# Altium schematic sheet BLE Reader.SchDoc
size 420 x 297 mm; Scale: 1:1; DocumentType: Схема электрическая принципиальная; FirstReferrence: АБВГ.123456.001
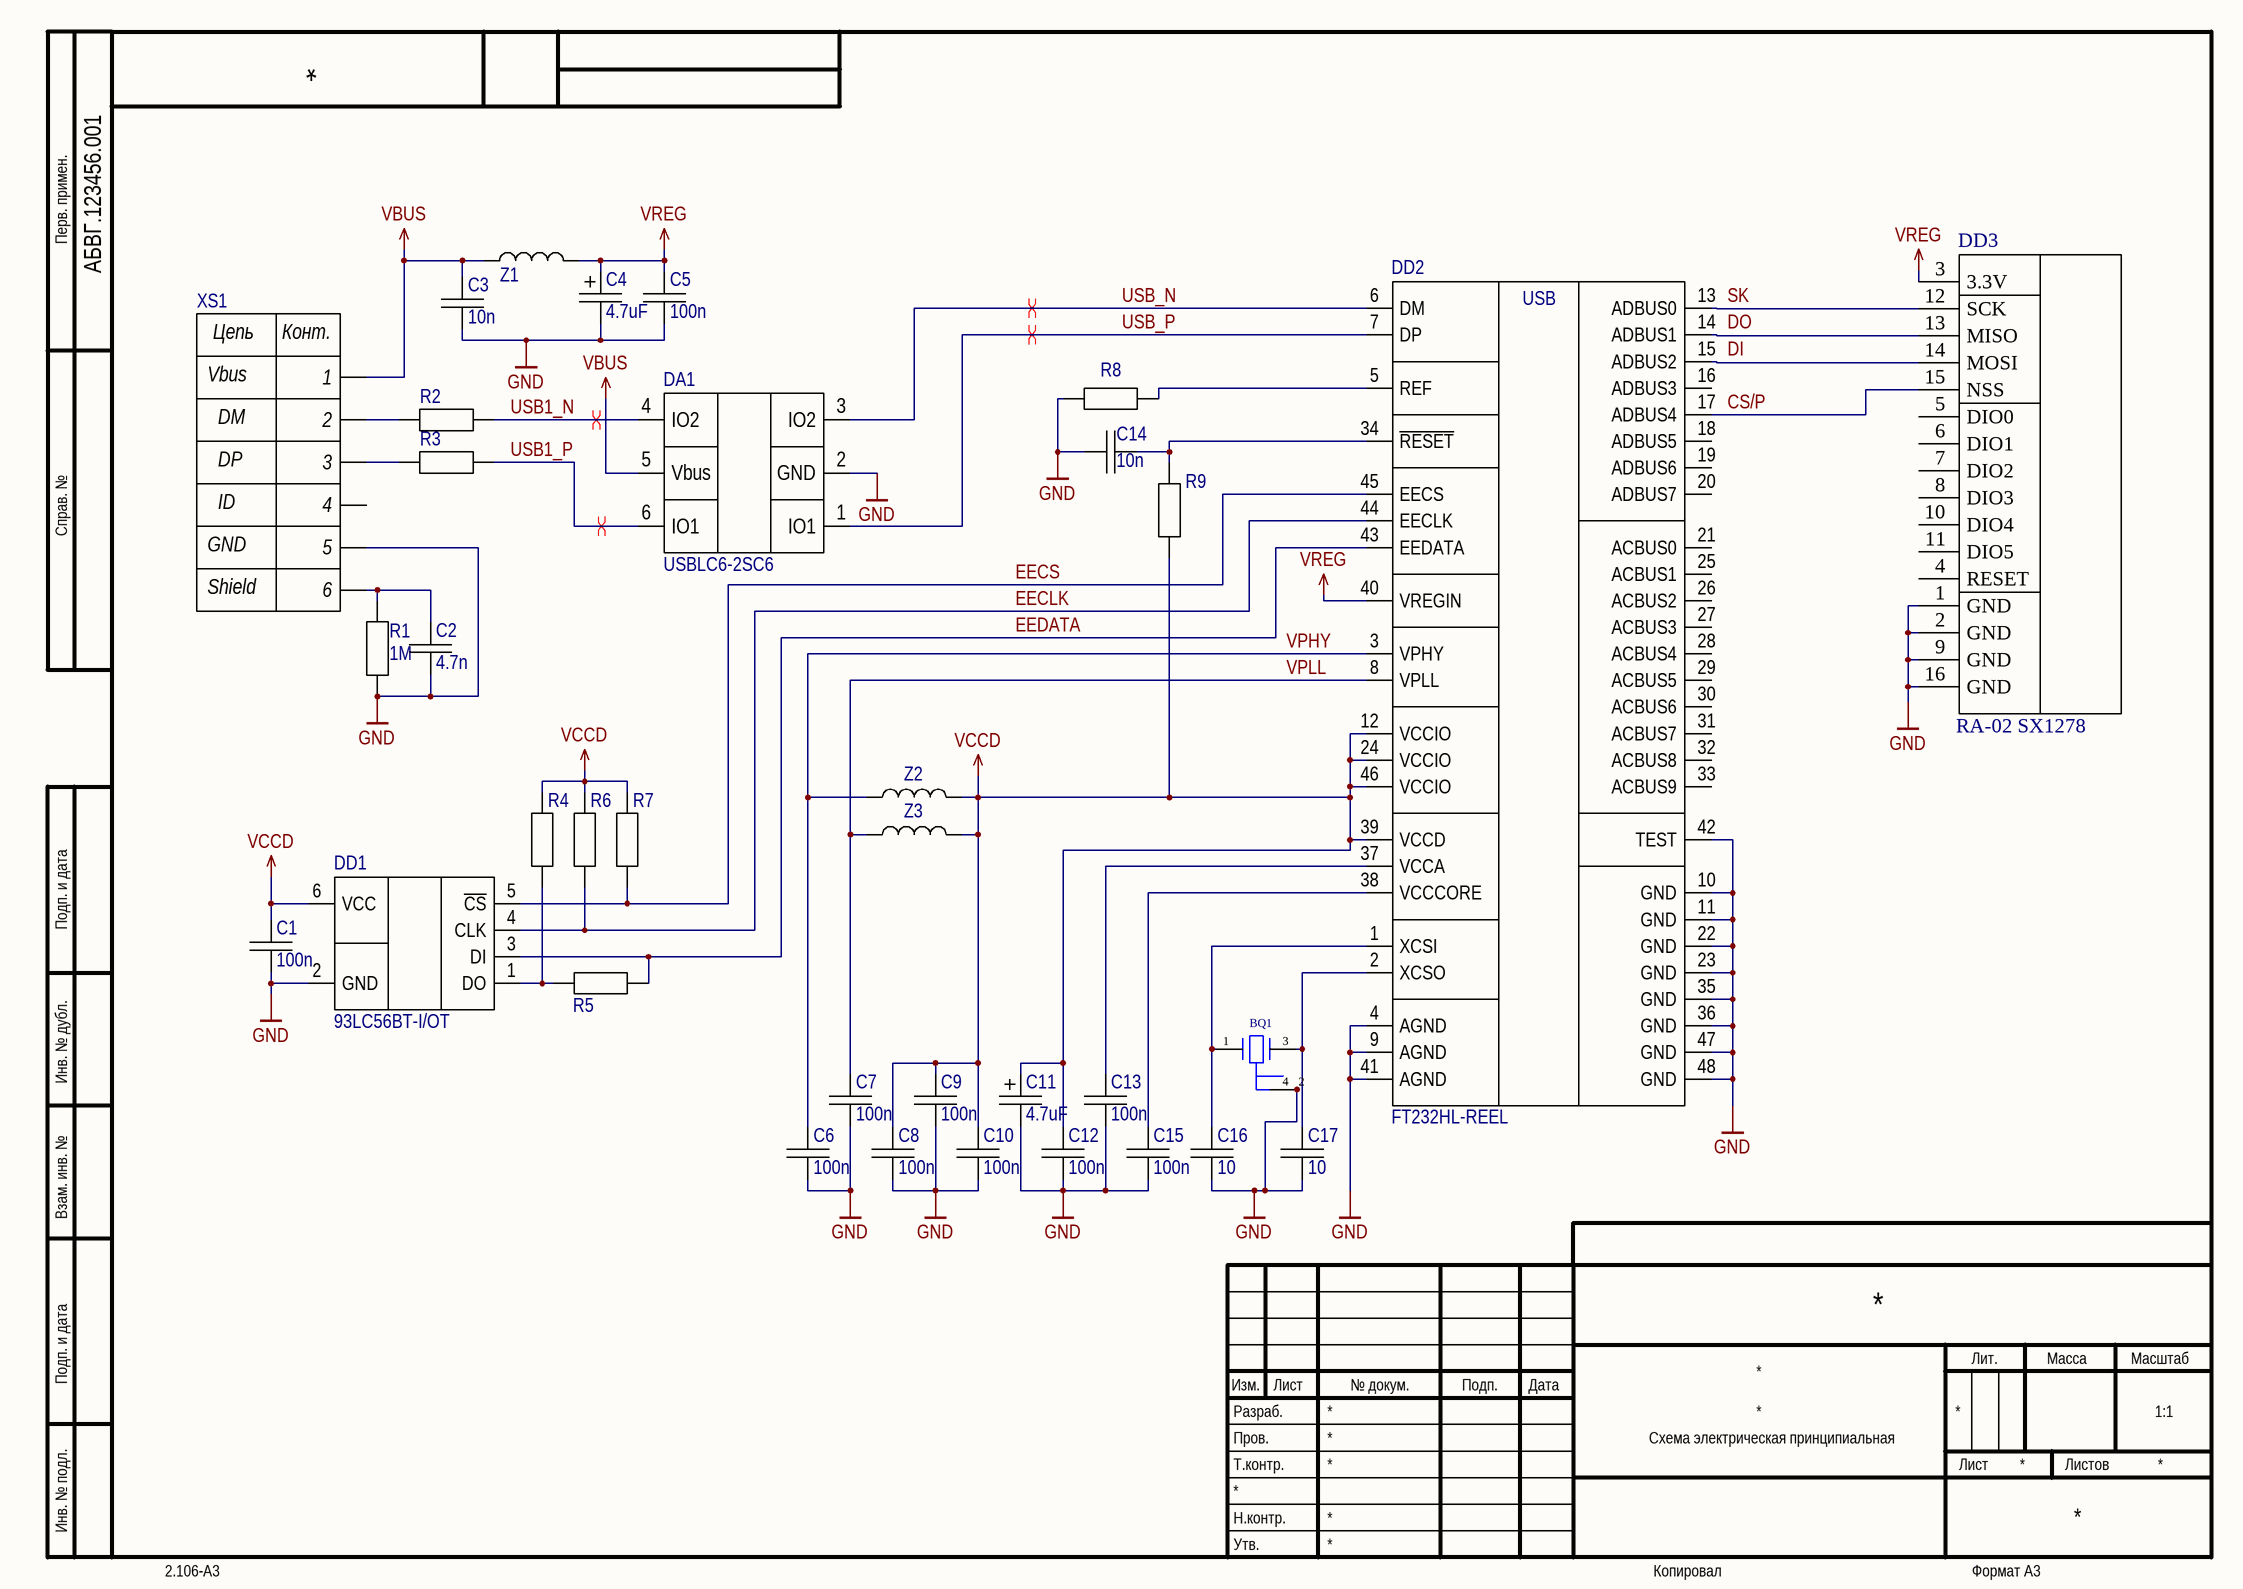
[diagram p0: BLE Reader.SchDoc]

## Parts
BQ1  ABM8G-12.000MHZ-4Y-T3  [Abracon_ABM8G_0]  (value not drawn)
C1  value 100n  [1608[0603]]  (hidden comment: *)
C2  value 4.7n  [1608[0603]]  (hidden comment: *)
C3  value 10n  [1608[0603]]  (hidden comment: *)
C4  value 4.7uF  [C1206]  (hidden comment: *)
C5  value 100n  [1608[0603]]  (hidden comment: *)
C6  value 100n  [1608[0603]]  (hidden comment: *)
C7  value 100n  [1608[0603]]  (hidden comment: *)
C8  value 100n  [1608[0603]]  (hidden comment: *)
C9  value 100n  [1608[0603]]  (hidden comment: *)
C10  value 100n  [1608[0603]]  (hidden comment: *)
C11  value 4.7uF  [C1206]  (hidden comment: *)
C12  value 100n  [1608[0603]]  (hidden comment: *)
C13  value 100n  [1608[0603]]  (hidden comment: *)
C14  value 10n  [1608[0603]]  (hidden comment: *)
C15  value 100n  [1608[0603]]  (hidden comment: *)
C16  value 10  [1608[0603]]  (hidden comment: *)
C17  value 10  [1608[0603]]  (hidden comment: *)
DA1  USBLC6-2SC6  [STMicroelectronics_USBLC6-2SC6_0]
DD1  93LC56BT-I/OT  [SOT-23-OT6_N]
DD2  FT232HL-REEL  [LQFP-48_L]
DD3  RA-02 SX1278  [RA-02]
R1  value 1M  [J1-0603]  (hidden comment: R1608)
R2  R1608  [J1-0603]  (value not drawn)
R3  R1608  [J1-0603]  (value not drawn)
R4  R1608  [J1-0603]  (value not drawn)
R5  R1608  [J1-0603]  (value not drawn)
R6  R1608  [J1-0603]  (value not drawn)
R7  R1608  [J1-0603]  (value not drawn)
R8  R1608  [J1-0603]  (value not drawn)
R9  R1608  [J1-0603]  (value not drawn)
XS1  UX60SC-MB-5S8(80)  [UX60SC-MB-5S8(80)]  (value not drawn)
Z1  BLM18AG601SN1D  [INDC1608L]  (value not drawn)
Z2  BLM18AG601SN1D  [INDC1608L]  (value not drawn)
Z3  BLM18AG601SN1D  [INDC1608L]  (value not drawn)

## Nets
GND: BQ1.2(GND) BQ1.4(GND) C1.1 C2.1 C3.1 C4.2 C5.1 C6.1 C7.1 C8.1 C9.1 C10.1 C11.2 C12.1 C13.1 C14.2 C15.1 C16.1 C17.1 DA1.2(GND) DD1.2(GND) DD2.4(AGND) DD2.9(AGND) DD2.10(GND) DD2.11(GND) DD2.22(GND) DD2.23(GND) DD2.35(GND) DD2.36(GND) DD2.41(AGND) DD2.42(TEST) DD2.47(GND) DD2.48(GND) DD3.1(GND) DD3.2(GND) DD3.9(GND) DD3.16(GND) R1.2 R8.2 XS1.5
VBUS: C3.2 DA1.5(Vbus) XS1.1 Z1.1
VCCD: C1.2 C8.2 C9.2 C10.2 C11.1 C12.2 DD1.6(VCC) DD2.12(VCCIO) DD2.24(VCCIO) DD2.39(VCCD) DD2.46(VCCIO) R4.2 R6.2 R7.2 R9.1 Z2.2 Z3.2
VREG: C4.1 C5.2 DD2.40(VREGIN) DD3.3(3.3V) Z1.2
CS/P: DD2.17(ADBUS4) DD3.15(NSS)
EECLK: DD1.4(CLK) DD2.44(EECLK) R6.1
EECS: DD1.5(~{CS}) DD2.45(EECS) R7.1
EEDATA: DD1.3(DI) DD2.43(EEDATA) R5.1
SK: DD2.13(ADBUS0) DD3.12(SCK)
USB1_N: DA1.4(IO2) R2.1
USB1_P: DA1.6(IO1) R3.1
USB_N: DA1.3(IO2) DD2.6(DM)
USB_P: DA1.1(IO1) DD2.7(DP)
VPHY: C6.2 DD2.3(VPHY) Z2.1
VPLL: C7.2 DD2.8(VPLL) Z3.1
NetBQ1_1: BQ1.1 C16.2 DD2.1(XCSI)
NetBQ1_3: BQ1.3 C17.2 DD2.2(XCSO)
NetC2_2: C2.2 R1.1 XS1.6
NetC13_2: C13.2 DD2.37(VCCA)
NetC14_1: C14.1 DD2.34(~{RESET}) R9.2
NetC15_2: C15.2 DD2.38(VCCCORE)
NetDD1_1: DD1.1(DO) R4.1 R5.2
NetDD2_5: DD2.5(REF) R8.1
NetDD2_14: DD2.14(ADBUS1) DD3.13(MISO)
NetDD2_15: DD2.15(ADBUS2) DD3.14(MOSI)
NetR2_2: R2.2 XS1.2
NetR3_2: R3.2 XS1.3

Not connected (* = marked no-connect by the designer): DD2 16(ADBUS3) 18(ADBUS5) 19(ADBUS6) 20(ADBUS7) 21(ACBUS0) 25(ACBUS1) 26(ACBUS2) 27(ACBUS3) 28(ACBUS4) 29(ACBUS5) 30(ACBUS6) 31(ACBUS7) 32(ACBUS8) 33(ACBUS9); DD3 4(RESET) 5(DIO0) 6(DIO1) 7(DIO2) 8(DIO3) 10(DIO4) 11(DIO5); XS1 4

## Layout directives
differential pair: USB1_N, USB1_P, USB_N, USB_P

## Notes on the sheet
- Labels drawn without touching a wire or pin: DI, DO
- Перв. примен.
- Справ. №
- Подп. и дата
- Инв. № дубл.
- Взам. инв. №
- Разраб.
- Изм.
- Лист
- № докум.
- Подп.
- Дата
- Лит.
- Масса
- Масштаб
- Пров.
- Т.контр.
- Листов
- Инв. № подл.
- Утв.
- Н.контр.
- 2.106-A3
- Копировал
- Формат А3
- (in symbol FT232HL-REEL) USB
- (in symbol UX60SC-MB-5S8(80)) Цепь; Конт.; Vbus; DM; DP; ID; GND; Shield

## Library data of the parts
C1 C5-C10 C12 C13 C15 = CC1608: Конденсатор 1.6x0.8 мм; Tolerance: ±10%; ТКЕ: X7R; РКД Наименование: CC1608M - NP0 - 16 V - 100 nF ±10%; Voltage: *; Type: *; PartNo: *; Supplier Part Number 1: *; Supplier 1: *
C2 = CC1608: Конденсатор 1.6x0.8 мм; Tolerance: ±10%; ТКЕ: X7R; РКД Наименование: CC1608M - NP0 - 16 V - 4.7 nF ±10%; Voltage: *; Type: *; PartNo: *; Supplier Part Number 1: *; Supplier 1: *
C3 C14 = CC1608: Конденсатор 1.6x0.8 мм; Tolerance: ±10%; ТКЕ: X7R; РКД Наименование: CC1608M - NP0 - 16 V - 10 nF ±10%; Voltage: *; Type: *; PartNo: *; Supplier Part Number 1: *; Supplier 1: *
C4 C11 = CT3216-A: Tantalum Surface Mount Capacitor, Size A; Voltage: 16; РКД Наименование: CT3216M - xx V - 4.7 uF ±10%; Type: *; PartNo: *; Supplier Part Number 1: *; Supplier 1: *
C16 C17 = CC1608: Конденсатор 1.6x0.8 мм; Tolerance: ±10%; ТКЕ: X7R; РКД Наименование: CC1608M - NP0 - 16 V - 10 pF ±10%; Voltage: *; Type: *; PartNo: *; Supplier Part Number 1: *; Supplier 1: *
DA1 = USBLC6-2SC6: USB protection IC; Manufacturer: STMicroelectronics; Direction: Bidirectional,Unidirectional; Capacitance: 3.5pF; Clamping Voltage: 17V; Operating Supply Voltage: 1.1V; Number of Channels: 2; Breakdown Voltage: 6V; Reverse Standoff Voltage: 5.25V; Power Line Protection: Yes; Test Current: 1mA; Max Reverse Leakage Current: 150nA; Peak Pulse Current: 5A; Element Configuration: Dual; Data Rate: 480Mbps; Number of Elements: 1; Working Voltage: 5V; PartNo: USBLC6-2SC6; Supplier 1: Digi-Key; Manufacturer Part Number: USBLC6-2SC6; Stock 1: 165611; Pricing 1: 1=0.49, 10=0.419, 100=0.3131, 500=0.24602, 1000=0.1901 (USD); Mount: Surface Mount; Case/Package: SOT-23; Number of Pins: 6; Contact Plating: Matte,Tin; Min Operating Temperature: -40°C; Max Operating Temperature: 125°C; Packaging: Tape and Reel; Package Quantity: 3000; Termination: SMD/SMT; Number of Bidirectional Channels: 2; Min Breakdown Voltage: 6V; ESD Protection: Yes; Leakage Current: 150nA; Reverse Breakdown Voltage: 6V; Polarity: Bidirectional,Unidirectional; Max Breakdown Voltage: 6V; Length: 3.05mm; Height: 1.3mm; Width: 1.75mm; Depth: 1.75mm; Radiation Hardening: No; REACH SVHC: No SVHC; Lead Free: Lead Free; ComponentLink1URL: http://www.farnell.com/datasheets/1690354.pdf; ComponentLink1Description: http://www.farnell.com/datasheets/1690354.pdf; ComponentLink2URL: http://www.st.com/content/ccc/resource/technical/document/datasheet/06/1d/48/9c/6c/20/4a/b2/CD00050750.pdf/files/CD00050750.pdf/jcr:content/translations/en.CD00050750.pdf; ComponentLink2Description: http://www.st.com/content/ccc/resource/technical/document/datasheet/06/1d/48/9c/6c/20/4a/b2/CD00050750.pdf/files/CD00050750.pdf/jcr:content/translations/en.CD00050750.pdf; ComponentLink3URL: http://www.st.com/web/en/resource/technical/document/datasheet/CD00050750.pdf; ComponentLink3Description: http://www.st.com/web/en/resource/technical/document/datasheet/CD00050750.pdf; ComponentLink4URL: http://datasheet.iiic.cc/stmicroelectronics/USBLC6-2SC6.pdf; ComponentLink4Description: http://datasheet.iiic.cc/stmicroelectronics/USBLC6-2SC6.pdf; ComponentLink5URL: http://www.produktinfo.conrad.com/datenblaetter/1100000-1199999/001184109-da-01-en-IC_ESD_PROTECTI_USBLC6_2SC6_SOT_23_6_STM.pdf; ComponentLink5Description: http://www.produktinfo.conrad.com/datenblaetter/1100000-1199999/001184109-da-01-en-IC_ESD_PROTECTI_USBLC6_2SC6_SOT_23_6_STM.pdf; Supplier Part Number 1: 497-5235-1-ND
DD1 = 93LC56BT-I/OT: IC EEPROM 2K SPI 2MHZ SOT23-6; Manufacturer: Microchip; Density: 2Kb; Interface: Serial; Max Supply Voltage: 5.5V; Min Supply Voltage: 2.5V; Access Time: 250ns; Nominal Supply Current: 2mA; Supplier 1: Digi-Key; Manufacturer Part Number: 93LC56BT-I/OT; Stock 1: 30936; Pricing 1: 1=0.23, 25=0.2164, 100=0.2119 (USD); Mount: Surface Mount; Case/Package: SOT-23; Number of Pins: 6; Contact Plating: Matte,Tin; Min Operating Temperature: -40°C; Max Operating Temperature: 85°C; Max Frequency: 2MHz; Packaging: Tape and Reel; Package Quantity: 3000; Memory Size: 2Kb; Frequency: 2MHz; Memory Type: EEPROM; Length: 3.1mm; Height: 1.3mm; Width: 1.8mm; Radiation Hardening: No; REACH SVHC: No SVHC; Lead Free: Lead Free; ComponentLink1URL: http://ww1.microchip.com/downloads/jp/DeviceDoc/jp013939.pdf; ComponentLink1Description: http://ww1.microchip.com/downloads/jp/DeviceDoc/jp013939.pdf; ComponentLink2URL: http://www.microchip.com/mymicrochip/filehandler.aspx?ddocname=en013939; ComponentLink2Description: http://www.microchip.com/mymicrochip/filehandler.aspx?ddocname=en013939; Supplier Part Number 1: 93LC56BT-I/OTCT-ND
DD2 = FT232HL-REEL: IC HS USB TO UART/FIFO 48LQFP; Manufacturer: FTDI; Max Supply Voltage: 3.63V; Interface: RS-232,RS-422,RS-485,UART; Operating Supply Current: 24mA; Min Supply Voltage: 2.97V; Operating Supply Voltage: 3.3V; Number of Channels: 1; Nominal Supply Current: 60mA; Data Rate: 12Mbps; Supplier 1: Digi-Key; Manufacturer Part Number: FT232HL-REEL; Stock 1: 26419; Pricing 1: 1=4.25, 10=3.55, 100=3.1, 250=2.95, 500=2.85002 (USD); Mount: Surface Mount; Case/Package: LQFP; Number of Pins: 48; Weight: 0.006409oz; Min Operating Temperature: -40°C; Max Operating Temperature: 85°C; Packaging: Tape and Reel; Package Quantity: 1; Length: 7mm; Height: 1.4mm; Width: 7mm; Lead Free: Lead Free; REACH SVHC: No SVHC; ComponentLink1URL: http://www.ftdichip.com/Support/Documents/DataSheets/ICs/DS_FT232H.pdf; ComponentLink1Description: http://www.ftdichip.com/Support/Documents/DataSheets/ICs/DS_FT232H.pdf; ComponentLink2URL: http://www.farnell.com/datasheets/1913746.pdf; ComponentLink2Description: http://www.farnell.com/datasheets/1913746.pdf; ComponentLink3URL: http://www.mouser.com/ds/2/163/DS_FT232H-11324.pdf; ComponentLink3Description: http://www.mouser.com/ds/2/163/DS_FT232H-11324.pdf; Supplier Part Number 1: 768-1101-1-ND
DD3 = RA-02
R1 = R1608: Резистор 1.6x0.8 мм; Manufacturer Part Number: RC0603JR-071ML; Tolerance: ±5%; РКД Наименование: RC1608M - 1 MOhm ±5%; Type: *; PartNo: *; Supplier 1: *; Supplier Part Number 1: 311-1.0MGRCT-ND
R2 R3 = R1608: Резистор 1.6x0.8 мм; Tolerance: ±1%; РКД Наименование: RC1608M - 22 Ohm ±1%; Value: 22; Type: *; PartNo: *; Supplier 1: *; Supplier Part Number 1: *
R4 R6 R7 R9 = R1608: Резистор 1.6x0.8 мм; Tolerance: ±5%; РКД Наименование: RC1608M - 10 kOhm ±5%; Value: 10k; Type: *; PartNo: *; Supplier 1: *; Supplier Part Number 1: *
R5 = R1608: Резистор 1.6x0.8 мм; Tolerance: ±5%; РКД Наименование: RC1608M - 2 kOhm ±5%; Value: 2k; Type: *; PartNo: *; Supplier 1: *; Supplier Part Number 1: *
R8 = R1608: Резистор 1.6x0.8 мм; Tolerance: ±1%; РКД Наименование: RC1608M - 12 kOhm ±1%; Value: 12k; Type: *; PartNo: *; Supplier 1: *; Supplier Part Number 1: *
XS1 = UX60SC-MB-5S8(80): USB - mini B USB 2.0 Receptacle Connector 5 Position Surface Mount, Right Angle; Through Hole; Manufacturer: Hirose; Voltage Rating: 30V; Current Rating: 1A; Number of Contacts: 5; Supplier 1: Digi-Key; Supplier Part Number 1: H125762CT-ND; Manufacturer Part Number: UX60SC-MB-5S8(80); Stock 1: 4220; Pricing 1: 1=0.8, 10=0.701, 25=0.66, 50=0.6326, 100=0.605, 250=0.55, 500=0.495 (USD); Mount: Surface Mount,Horizontal,Through Hole; Contact Material: Copper Alloy; Min Operating Temperature: -30°C; Max Operating Temperature: 75°C; Package Quantity: 1000; Packaging: Tape and Reel; Gender: Receptacle; Connector Type: USB; Termination: Solder; Orientation: Right Angle; ComponentLink1URL: https://media.digikey.com/pdf/Data%20Sheets/Hirose%20PDFs/UX60S.pdf?src-supplier=Digi-Key; ComponentLink1Description: https://media.digikey.com/pdf/Data%20Sheets/Hirose%20PDFs/UX60S.pdf?src-supplier=Digi-Key
Z1-Z3 = BLM18AG601SN1D: FERRITE CHIP 600 OHM 500MA 0603; Manufacturer: Murata; Tolerance: 25%; Impedance: 600R; Number of Lines: 1; DC Resistance (DCR): 380mR; Test Frequency: 100MHz; Shielding: Unshielded; Supplier 1: Digi-Key; Manufacturer Part Number: BLM18AG601SN1D; Stock 1: 1068043; Pricing 1: 1=0.1, 10=0.079, 25=0.072, 50=0.0648, 100=0.0476, 250=0.0346, 500=0.0317, 1000=0.02738 (USD); Case/Package: 0603; Number of Pins: 2; Weight: 7.1E-05oz; Core Material: Ferrite; Case Code (Metric): 1608; Case Code (Imperial): 0603; Material: Ferrite,Steel; Min Operating Temperature: -55°C; Max Operating Temperature: 125°C; Package Quantity: 1; Max Current Rating: 500mA; Packaging: Tape and Reel; Current Rating: 500mA; Termination: SMD/SMT; Max DC Current: 500mA; DC Current: 500mA; Military Standard: Not; Frequency: 100MHz; Number of Circuits: 1; Length: 1.6mm; Height: 0.8mm; Width: 0.8mm; Depth: 0.8mm; Radiation Hardening: No; REACH SVHC: No SVHC; Lead Free: Lead Free; ComponentLink1URL: https://www.murata.com/en-us/products/productdata/8796738650142/ENFA0003.pdf; ComponentLink1Description: https://www.murata.com/en-us/products/productdata/8796738650142/ENFA0003.pdf; ComponentLink2URL: http://www.farnell.com/datasheets/1756147.pdf; ComponentLink2Description: http://www.farnell.com/datasheets/1756147.pdf; ComponentLink3URL: http://www.jameco.com/Jameco/Products/ProdDS/1844766.pdf; ComponentLink3Description: http://www.jameco.com/Jameco/Products/ProdDS/1844766.pdf; ComponentLink4URL: http://search.murata.co.jp/Ceramy/image/img/PDF/ENG/L0110S0100BLM18A.pdf; ComponentLink4Description: http://search.murata.co.jp/Ceramy/image/img/PDF/ENG/L0110S0100BLM18A.pdf; ComponentLink5URL: http://www.produktinfo.conrad.com/datenblaetter/425000-449999/442309-da-01-en-CHIP_DROSSEL_0603_600R_500MA_1_6X0_8MM.pdf; ComponentLink5Description: http://www.produktinfo.conrad.com/datenblaetter/425000-449999/442309-da-01-en-CHIP_DROSSEL_0603_600R_500MA_1_6X0_8MM.pdf; ComponentLink6URL: http://www.produktinfo.conrad.com/datenblaetter/1100000-1199999/001172228-da-01-en-DROSSEL_0603_600R_1_6X0_8MM_4000ST.pdf; ComponentLink6Description: http://www.produktinfo.conrad.com/datenblaetter/1100000-1199999/001172228-da-01-en-DROSSEL_0603_600R_1_6X0_8MM_4000ST.pdf; Supplier Part Number 1: 490-1014-1-ND